# EAGLE design OldLineFollowerRecreate (EAGLE 7.5.0)
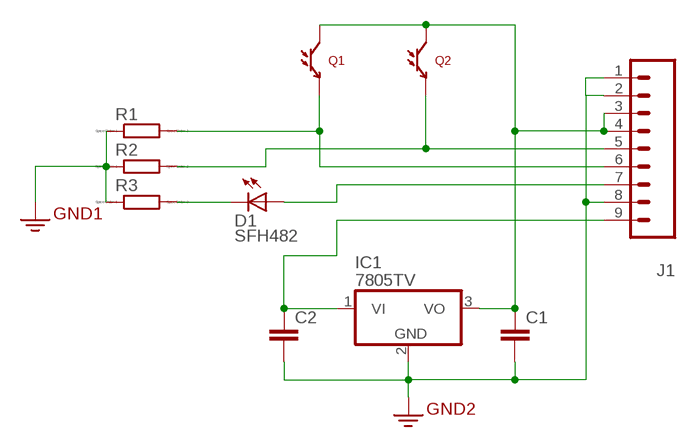
[diagram p0: schematic, sheet 1]

## Parts
C1  C2.5/5  [C2.5-5]
C2  C2.5/5  [C2.5-5]
D1  SFH482  [SFH482]
IC1  7805TV  [TO220V]
J1  M09  [1X09]
Q1  LTR-301  [LTR-301]
Q2  LTR-301  [LTR-301]
R1  R0204/7  [0204/7]
R2  R0204/7  [0204/7]
R3  R0204/7  [0204/7]

## Nets
3.3V: C1.2 C2.2 IC1.2(GND) J1.1 J1.2 J1.8 R1.1 R2.1 R3.1 ; supply symbol labelled GND2
N$1: C2.1 IC1.1(VI) J1.9
N$6: C1.1 IC1.3(VO) J1.3 J1.4 Q1.C Q2.C
N$8: D1.K(C) R3.2
N$9: D1.A J1.7
N$11: J1.6 Q1.E R1.2
N$12: J1.5 Q2.E R2.2

## Library data of the parts
C1 C2 = capacitor-wima:C: CAPACITOR naming: grid - package width
D1 = led:SFH482: IR LED infrared emitting diode, Infineon
IC1 = linear:78*: Positive VOLTAGE REGULATOR Source: http://cache.national.com/ds/LM/LM78L05.pdf http://www.fairchildsemi.com/ds/LM/LM7805.pdf
J1 = SparkFun-Connectors:M09: Header 9 Standard 9-pin 0.1" header. Use with straight break away headers (SKU : PRT-00116), right angle break away headers (PRT-00553), swiss pins (PRT-00743), machine pins (PRT-00117), and female headers (PRT-00115).
Q1 Q2 = SparkFun-Sensors:LTR-301: Through-hole side-receiving IR phototransistor
R1-R3 = eagle-ltspice:R: RESISTOR, European symbol; SPICEMODEL: NONE; SPICEPREFIX: R

## Net classes
0 default: width 0.508 mm, clearance 0.254 mm

## Board
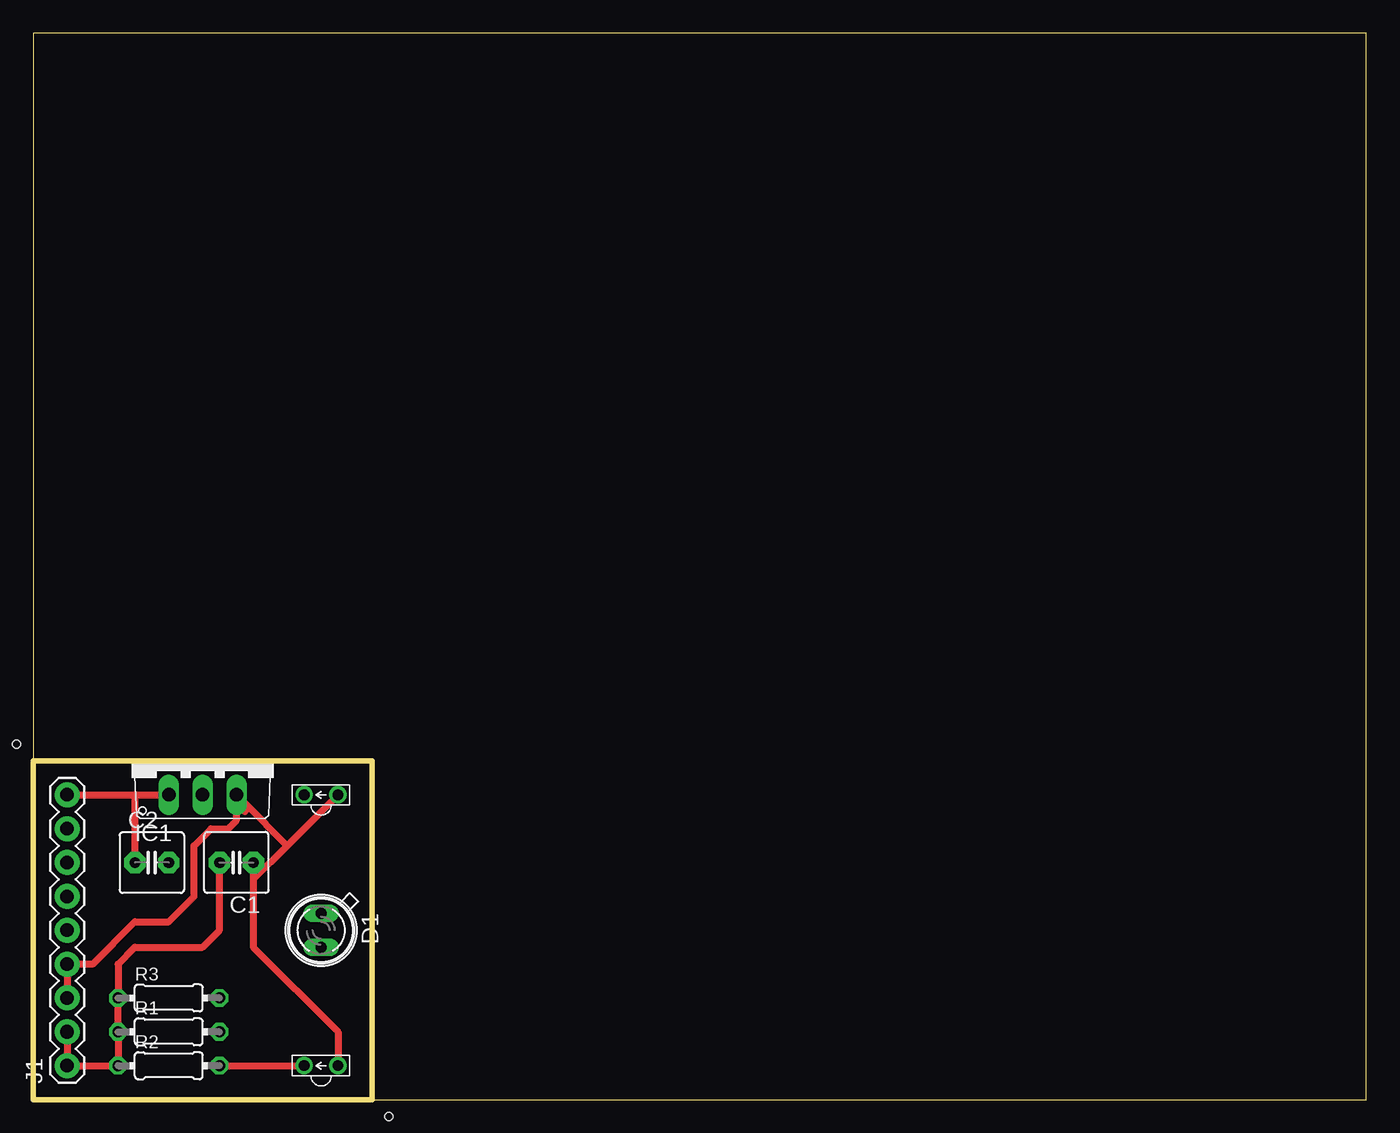
[diagram p1: board, top side]
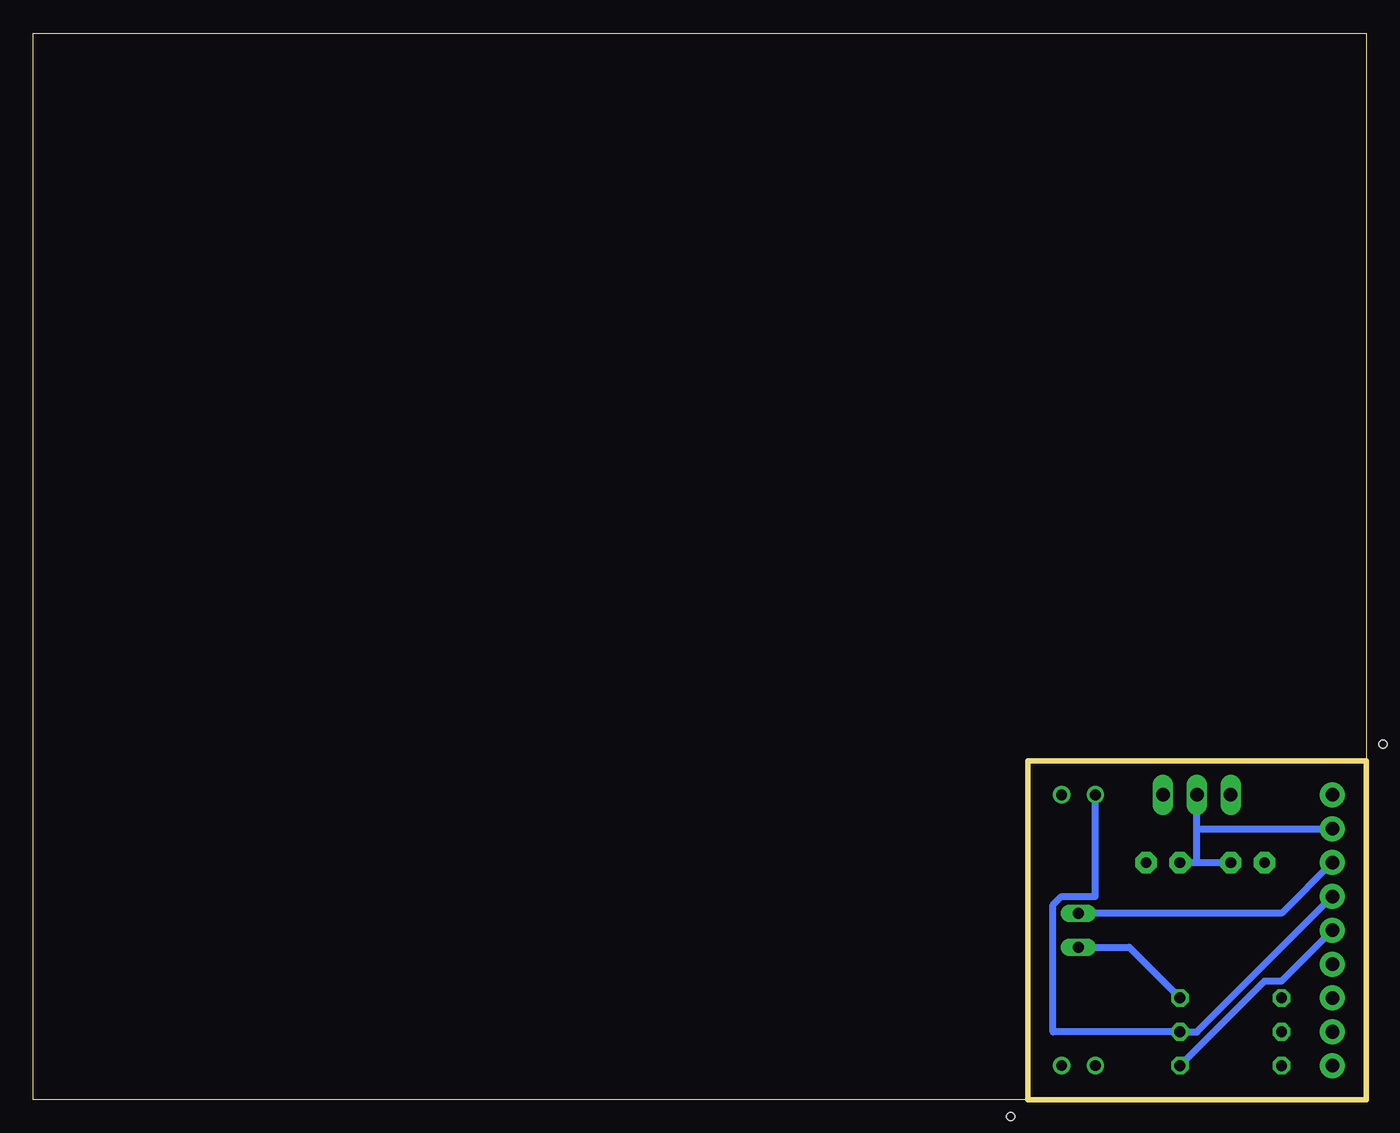
[diagram p2: board, bottom side, seen from below]

Size 100 x 80 mm. Coordinates in mm from the lower left corner, seen from the top.
Outline: 25.4,0 100,0 100,80 0,80 0,25.4
Outline: 0,25.4 0,0 25.4,0
Outline: 0,25.4 25.4,25.4 25.4,0
Copper layers (1*16): Top 0.035mm / dielectric 1.5mm / Bottom 0.035mm
Design rules "default": minimum track width 10mil, minimum drill 24mil, track to track 8mil, track to pad 8mil, pad to pad 8mil, via to via 8mil, smd to smd 8mil, copper to edge 40mil, drill to drill 8mil, minimum pad ring 10mil, minimum via ring 8mil, stop-mask expansion 4mil, vias tented up to drill 0mil, thermal gap 10mil
Holes 0.6 mm at -1.27,26.67 26.67,-1.27

### Footprints (pad centres in the part's own frame; a part is rotated, then mirrored left to right if it is on the bottom)
C2.5-5 = drill 0.813 pad 1.6 octagon: 1 -1.27,0; 2 1.27,0
SFH482 = drill 0.813 long: A -1.27,0; K 1.27,0
TO220V = drill 1.016 long: 1 -2.54,-2.54; 2 0,-2.54; 3 2.54,-2.54
1X09 = drill 1.016 pad 1.88: 1 0,0; 2 2.54,0; 3 5.08,0; 4 7.62,0; 5 10.16,0; 6 12.7,0; 7 15.24,0; 8 17.78,0; 9 20.32,0
LTR-301 = drill 0.8: C 1.27,0; E -1.27,0
0204/7 = drill 0.813 octagon: 1 -3.81,0; 2 3.81,0

### Placement (x,y rotation side)
C1  15.24,17.78 180 top
C2  8.89,17.78 0 top
D1  21.59,12.7 270 top
IC1  12.7,25.4 0 top
J1  2.54,2.54 90 top
Q1  21.59,22.86 0 top
Q2  21.59,2.54 0 top
R1  10.16,5.08 0 top
R2  10.16,2.54 0 top
R3  10.16,7.62 0 top

### Tracks (layer width: path | path; a pad name or v marks a point on that pad's centre or on a via)
3.3V
  Top 0.508: J1.2 J1.1 R2.1 R1.1 R3.1 6.35,10.16 7.62,11.43 12.7,11.43 13.97,12.7 C1.2
  Bottom 0.508: 12.7,17.78 12.7,20.32 | 12.7,20.32 IC1.2 | C1.2 12.7,17.78 | 12.7,17.78 C2.2 | 12.7,20.32 J1.8
N$1
  Top 0.508: J1.9 7.62,22.86 | 7.62,22.86 IC1.1 | 7.62,22.86 C2.1
N$6
  Top 0.508: J1.3 J1.4 4.45,10.16 7.62,13.34 10.16,13.34 12.06,15.24 12.06,19.05 13.34,20.32 14.61,20.32 15.24,20.95 IC1.3 15.88,22.23 | Q2.C 22.86,5.08 16.51,11.43 16.51,16.51 | C1.1 16.51,16.51 | 16.51,16.51 19.05,19.05 | 19.05,19.05 Q1.C | 19.05,19.05 15.88,22.23 | 15.88,22.23 15.88,21.59
N$8
  Bottom 0.508: R3.2 17.78,11.43 D1.K
N$9
  Bottom 0.508: D1.A 6.35,13.97 J1.7
N$11
  Bottom 0.508: Q1.E 20.32,15.24 22.86,15.24 23.5,14.61 23.5,5.08 R1.2 12.7,5.08 J1.6
N$12
  Top 0.508: R2.2 Q2.E
  Bottom 0.508: J1.5 6.35,8.89 7.62,8.89 R2.2